# Altium schematic sheet TOP.SchDoc
size A4; SheetNumber: 1; SheetTotal: 6
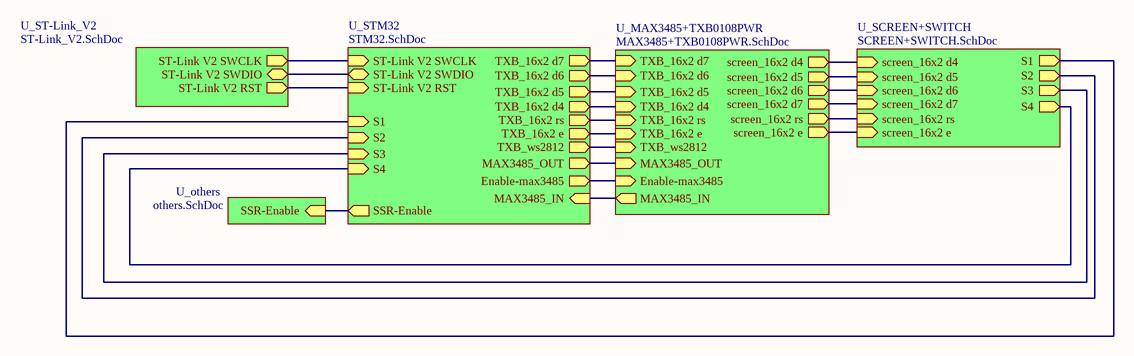
[diagram p0: TOP.SchDoc]

## Sub-sheets
U_MAX3485+TXB0108PWR = MAX3485+TXB0108PWR.SchDoc: Enable-max3485 (in), screen_16x2 d4 (out), screen_16x2 d5 (out), screen_16x2 d6 (out), screen_16x2 d7 (out), screen_16x2 rs (out), screen_16x2 e (out), TXB_16x2 d4 (in), TXB_16x2 d5 (in), TXB_16x2 d6 (in), TXB_16x2 d7 (in), TXB_16x2 rs (in), TXB_16x2 e (in), TXB_ws2812 (in), MAX3485_OUT (in), MAX3485_IN (out)
U_others = others.SchDoc: SSR-Enable (in)
U_SCREEN+SWITCH = SCREEN+SWITCH.SchDoc: screen_16x2 d4 (in), screen_16x2 d5 (in), screen_16x2 d6 (in), screen_16x2 d7 (in), screen_16x2 e (in), S4 (out), S1 (out), S2 (out), S3 (out), screen_16x2 rs (in)
U_ST-Link_V2 = ST-Link_V2.SchDoc: ST-Link V2 SWDIO (bidir), ST-Link V2 SWCLK (out), ST-Link V2 RST (out)
U_STM32 = STM32.SchDoc: ST-Link V2 SWCLK (in), ST-Link V2 SWDIO (bidir), TXB_16x2 d7 (out), ST-Link V2 RST (in), Enable-max3485 (out), TXB_16x2 d4 (out), TXB_16x2 d5 (out), TXB_16x2 d6 (out), TXB_16x2 rs (out), TXB_16x2 e (out), S2 (in), S3 (in), S4 (in), S1 (in), SSR-Enable (out), TXB_ws2812 (out), MAX3485_IN (in), MAX3485_OUT (out)

## Nets
(unnamed): sheet U_STM32/ST-Link V2 SWCLK, sheet U_ST-Link_V2/ST-Link V2 SWCLK
(unnamed): sheet U_STM32/ST-Link V2 SWDIO, sheet U_ST-Link_V2/ST-Link V2 SWDIO
(unnamed): sheet U_STM32/TXB_16x2 d7, sheet U_MAX3485+TXB0108PWR/TXB_16x2 d7
(unnamed): sheet U_STM32/ST-Link V2 RST, sheet U_ST-Link_V2/ST-Link V2 RST
(unnamed): sheet U_STM32/Enable-max3485, sheet U_MAX3485+TXB0108PWR/Enable-max3485
(unnamed): sheet U_STM32/TXB_16x2 d4, sheet U_MAX3485+TXB0108PWR/TXB_16x2 d4
(unnamed): sheet U_STM32/TXB_16x2 d5, sheet U_MAX3485+TXB0108PWR/TXB_16x2 d5
(unnamed): sheet U_STM32/TXB_16x2 d6, sheet U_MAX3485+TXB0108PWR/TXB_16x2 d6
(unnamed): sheet U_STM32/TXB_16x2 rs, sheet U_MAX3485+TXB0108PWR/TXB_16x2 rs
(unnamed): sheet U_STM32/TXB_16x2 e, sheet U_MAX3485+TXB0108PWR/TXB_16x2 e
(unnamed): sheet U_STM32/S2, sheet U_SCREEN+SWITCH/S2
(unnamed): sheet U_STM32/S3, sheet U_SCREEN+SWITCH/S3
(unnamed): sheet U_STM32/S4, sheet U_SCREEN+SWITCH/S4
(unnamed): sheet U_STM32/S1, sheet U_SCREEN+SWITCH/S1
(unnamed): sheet U_STM32/SSR-Enable, sheet U_others/SSR-Enable
(unnamed): sheet U_STM32/TXB_ws2812, sheet U_MAX3485+TXB0108PWR/TXB_ws2812
(unnamed): sheet U_STM32/MAX3485_IN, sheet U_MAX3485+TXB0108PWR/MAX3485_IN
(unnamed): sheet U_STM32/MAX3485_OUT, sheet U_MAX3485+TXB0108PWR/MAX3485_OUT
(unnamed): sheet U_SCREEN+SWITCH/screen_16x2 d4, sheet U_MAX3485+TXB0108PWR/screen_16x2 d4
(unnamed): sheet U_SCREEN+SWITCH/screen_16x2 d5, sheet U_MAX3485+TXB0108PWR/screen_16x2 d5
(unnamed): sheet U_SCREEN+SWITCH/screen_16x2 d6, sheet U_MAX3485+TXB0108PWR/screen_16x2 d6
(unnamed): sheet U_SCREEN+SWITCH/screen_16x2 d7, sheet U_MAX3485+TXB0108PWR/screen_16x2 d7
(unnamed): sheet U_SCREEN+SWITCH/screen_16x2 e, sheet U_MAX3485+TXB0108PWR/screen_16x2 e
(unnamed): sheet U_SCREEN+SWITCH/screen_16x2 rs, sheet U_MAX3485+TXB0108PWR/screen_16x2 rs